# Altium schematic sheet NeuroBB.SchDoc
size A; SheetNumber: 1; SheetTotal: 6
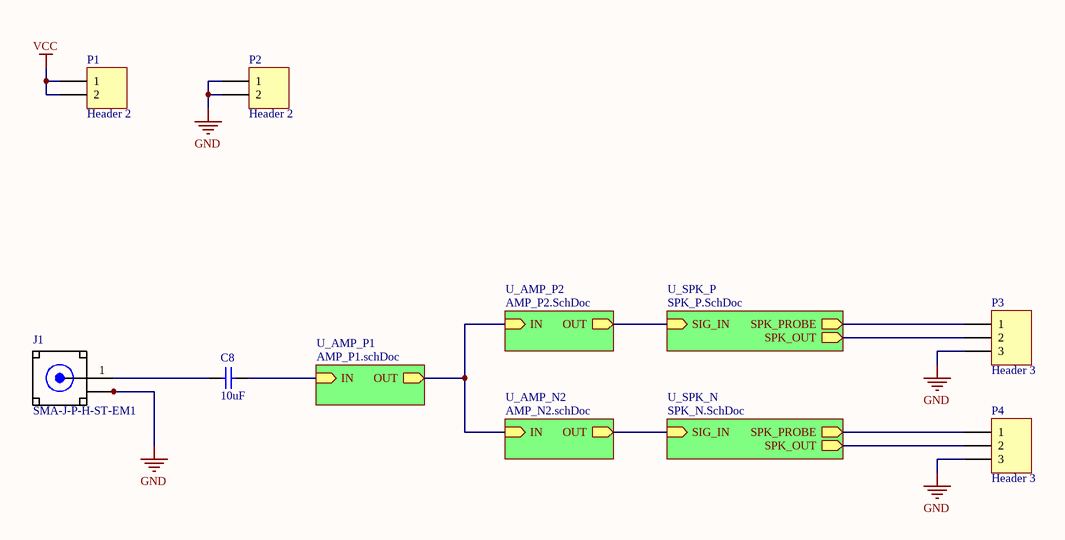
[diagram p0: NeuroBB.SchDoc]

## Parts
C8  10uF  [SMD-0603]
J1  SMA-J-P-H-ST-EM1  [SMA-J-P-H-ST-EM1]
P1  Header 2  [HDR1X2]
P2  Header 2  [HDR1X2]
P3  Header 3  [HDR1X3]
P4  Header 3  [HDR1X3]

## Sub-sheets
U_AMP_N2 = AMP_N2.schDoc: OUT (out), IN (in)
U_AMP_P1 = AMP_P1.schDoc: OUT (out), IN (in)
U_AMP_P2 = AMP_P2.SchDoc: OUT (out), IN (in)
U_SPK_N = SPK_N.SchDoc: SPK_OUT (out), SIG_IN (in), SPK_PROBE (out)
U_SPK_P = SPK_P.SchDoc: SPK_OUT (out), SIG_IN (in), SPK_PROBE (out)

## Nets
GND: J1.2_1(GND) J1.2_2(GND) J1.3_1(GND) J1.3_2(GND) P2.1 P2.2 P3.3 P4.3
VCC: P1.1 P1.2
NetC8_1: C8.1 J1.1(SIGNAL)
NetC8_2: C8.2 ; sheet U_AMP_P1/IN
NetP3_1: P3.1 ; sheet U_SPK_P/SPK_PROBE
NetP3_2: P3.2 ; sheet U_SPK_P/SPK_OUT
NetP4_1: P4.1 ; sheet U_SPK_N/SPK_PROBE
NetP4_2: P4.2 ; sheet U_SPK_N/SPK_OUT
(unnamed): sheet U_AMP_P1/OUT, sheet U_AMP_N2/IN, sheet U_AMP_P2/IN
(unnamed): sheet U_AMP_N2/OUT, sheet U_SPK_N/SIG_IN
(unnamed): sheet U_AMP_P2/OUT, sheet U_SPK_P/SIG_IN

## Library data of the parts
C8 = CAP0603: Ceramic Capacitor 0603
J1 = SMA-J-P-H-ST-EM1: Connector SMA F 50Ohm Solder ST Edge Mount Gold Over Nickel Tray; MF: Samtec; Price: None; SnapEDA_Link: https://www.snapeda.com/parts/SMA-J-P-H-ST-EM1/Samtec%20Inc./view-part/?ref=snap; MP: SMA-J-P-H-ST-EM1; Package: None; Availability: Unavailable; Value: *
P1 P2 = Header 2: Header, 2-Pin; LatestRevisionDate: 17-Jul-2002; LatestRevisionNote: Re-released for DXP Platform.; Publisher: Altium Limited
P3 P4 = Header 3: Header, 3-Pin; LatestRevisionDate: 17-Jul-2002; LatestRevisionNote: Re-released for DXP Platform.; Publisher: Altium Limited